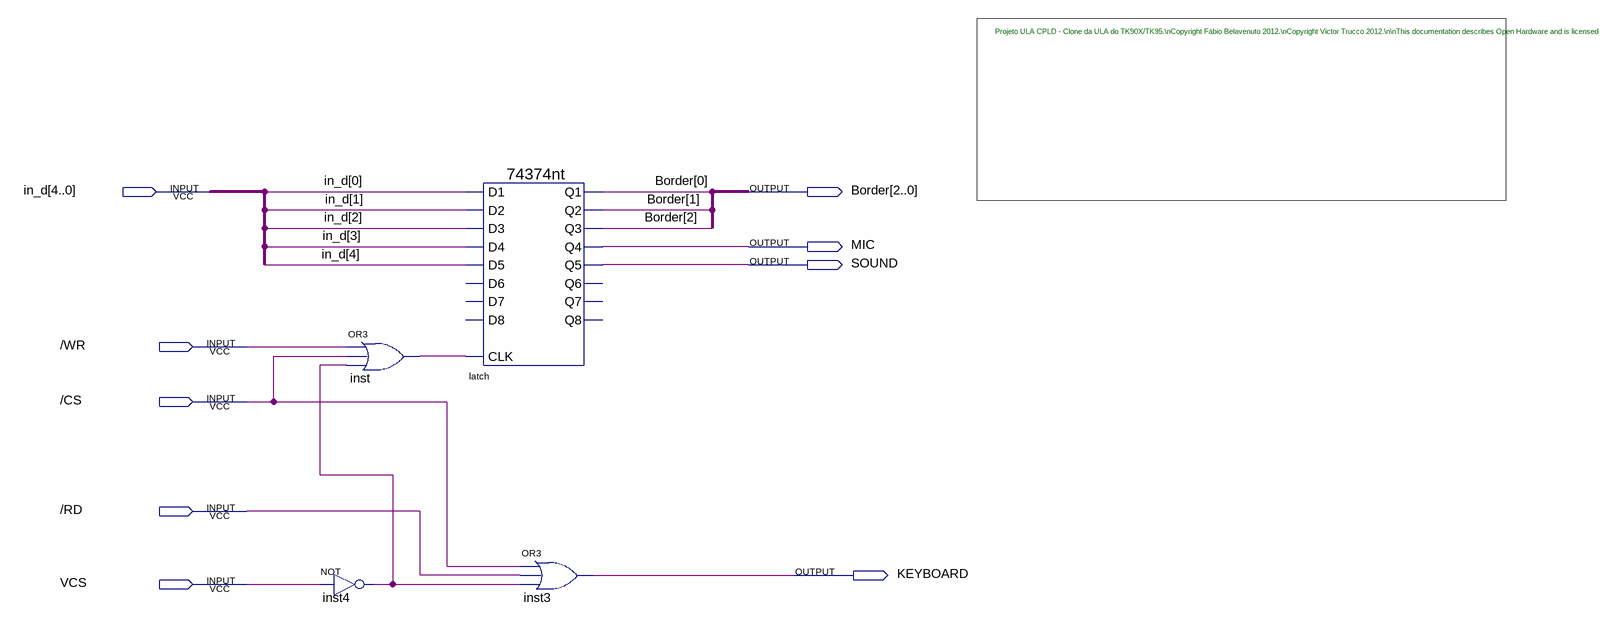
[diagram p0: schematic sheet]
// Quartus schematic Porta254.bdf as structural Verilog: 4 symbols, 9 pins
module Porta254 (
  input  [4:0] in_d,
  input  \/WR ,
  input  \/CS ,
  input  \/RD ,
  input  VCS,
  output [2:0] Border,
  output MIC,
  output SOUND,
  output KEYBOARD
);

  wire inst4_out, inst_out;

  not inst4 (inst4_out, VCS);
  or inst (inst_out, \/WR , \/CS , inst4_out);
  \74374nt  latch (
    .D3(in_d[2]), .D2(in_d[1]), .D1(in_d[0]), .D4(in_d[3]), .D5(in_d[4]), .CLK(inst_out), .Q3(Border[2]),
    .Q4(MIC), .Q5(SOUND), .Q1(Border[0]), .Q2(Border[1]));  // open: D7, D6, D8, Q8, Q7, Q6
  or inst3 (KEYBOARD, \/CS , \/RD , inst4_out);

  // Notes on the sheet:
  //   Projeto ULA CPLD - Clone da ULA do TK90X/TK95.\nCopyright Fábio Belavenuto 2012.\nCopyright Victor Trucco 2012.\n\nThis documentation describes Open Hardware and is licensed under the CERN OHL v. 1.1.\nYou may redistribute and modify this documentation under the terms of the\nCERN OHL v.1.1. (http://ohwr.org/cernohl). This documentation is distributed\nWITHOUT ANY EXPRESS OR IMPLIED WARRANTY, INCLUDING OF MERCHANTABILITY,\nSATISFACTORY QUALITY AND FITNESS FOR A PARTICULAR PURPOSE.\nPlease see the CERN OHL v.1.1 for applicable conditions
endmodule
